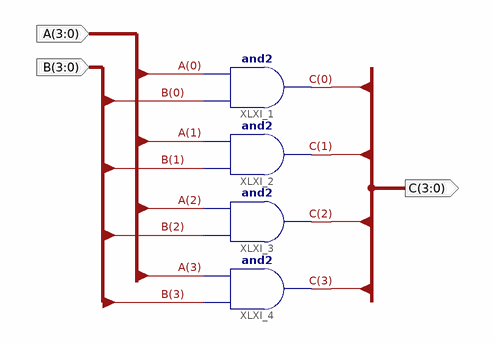
[diagram p0: schematic sheet 1]
// Xilinx ISE schematic MyAND2b4.sch (kintex7) as structural Verilog: 4 symbols, 3 ports
module MyAND2b4 (
  input  [3:0] A,
  input  [3:0] B,
  output [3:0] C
);

  and XLXI_1 (C[0], B[0], A[0]);
  and XLXI_2 (C[1], B[1], A[1]);
  and XLXI_3 (C[2], B[2], A[2]);
  and XLXI_4 (C[3], B[3], A[3]);
endmodule
